# EAGLE schematic MINI_MAST (EAGLE 9.5.1)
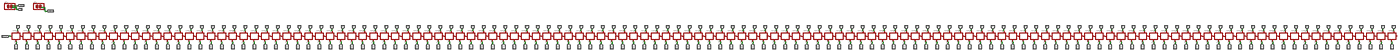
[diagram p0: schematic, sheet 1, overview]
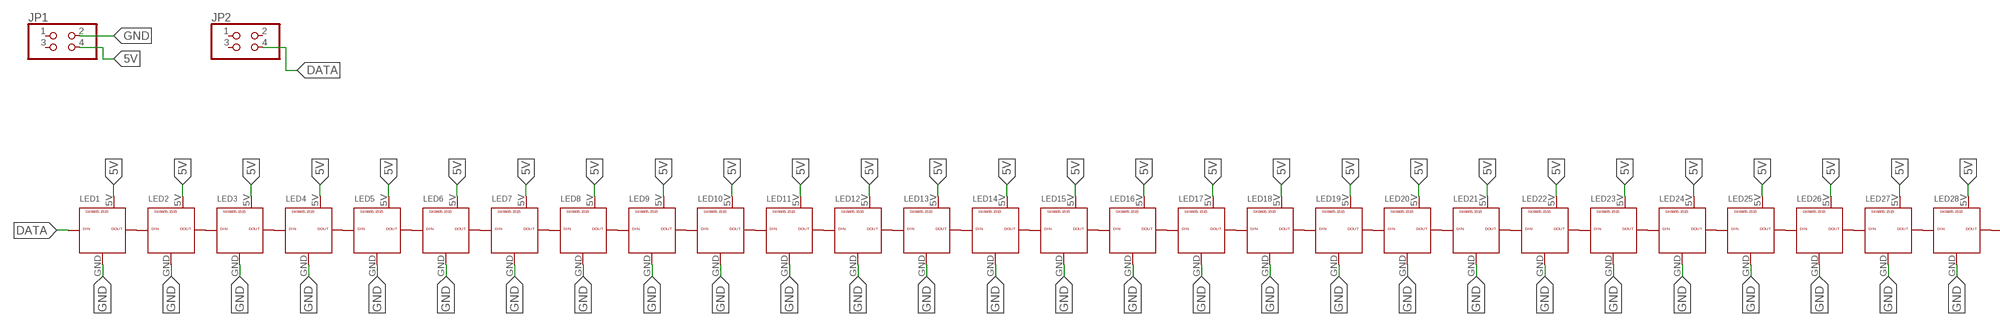
[diagram p1: schematic, sheet 1, part 1 of 6]
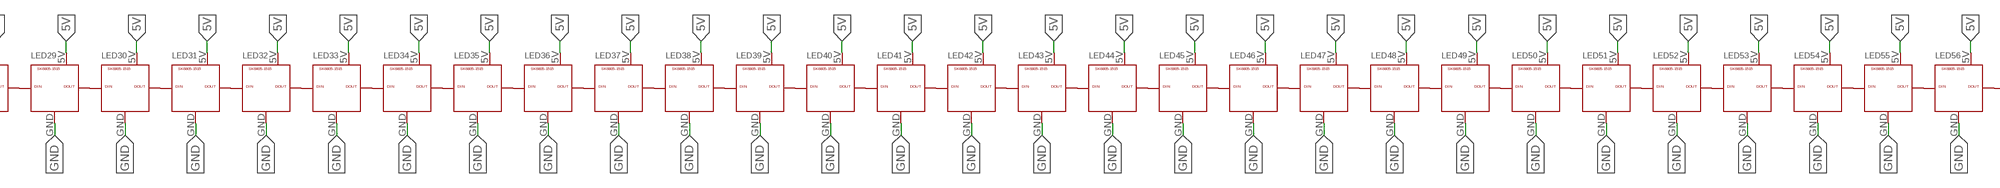
[diagram p2: schematic, sheet 1, part 2 of 6]
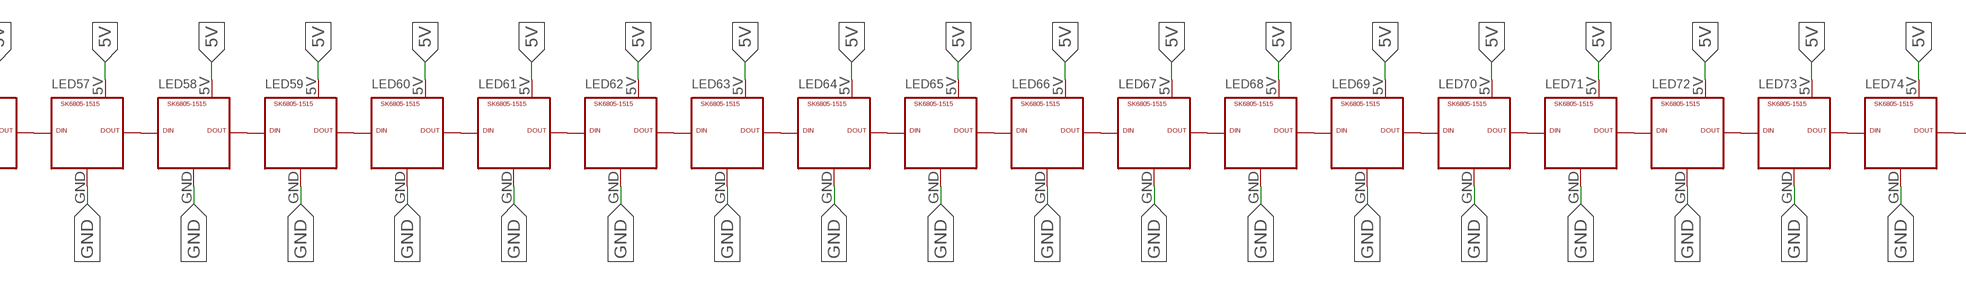
[diagram p3: schematic, sheet 1, part 3 of 6]
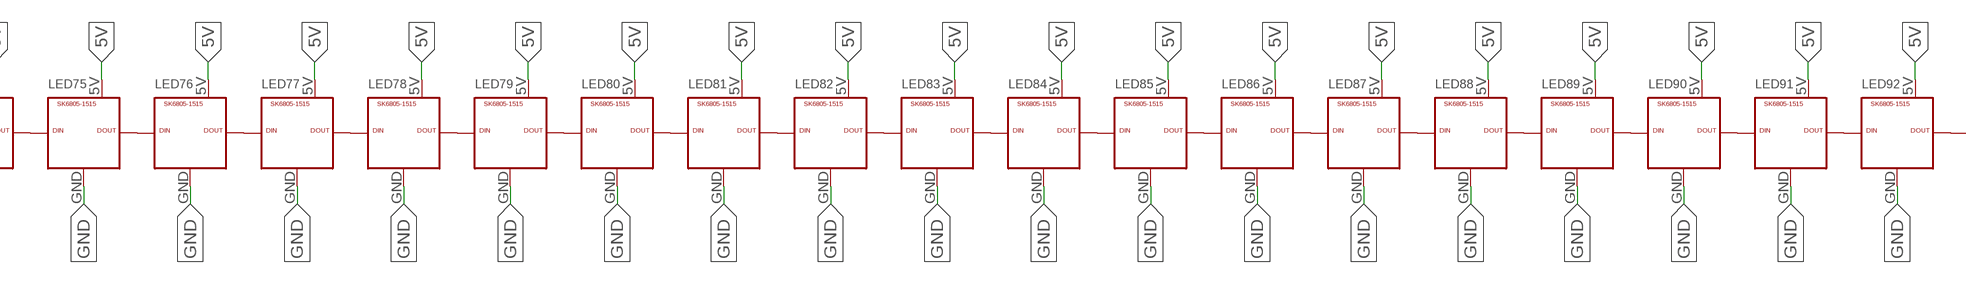
[diagram p4: schematic, sheet 1, part 4 of 6]
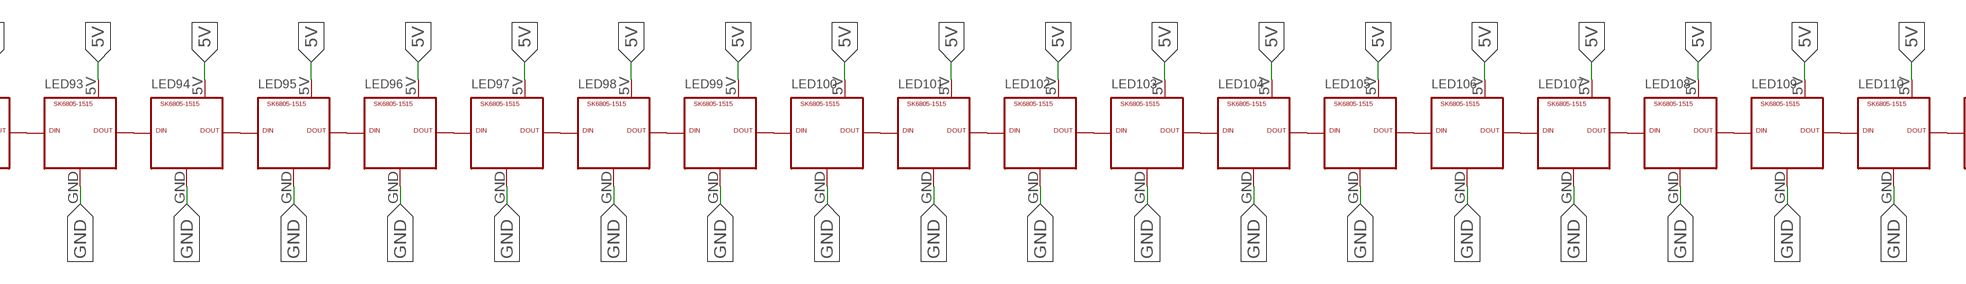
[diagram p5: schematic, sheet 1, part 5 of 6]
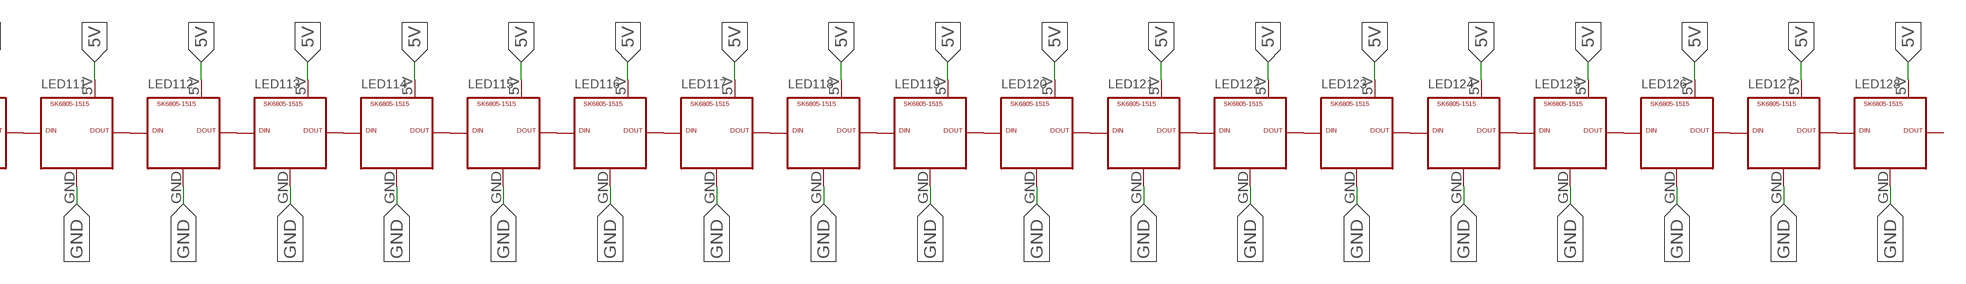
[diagram p6: schematic, sheet 1, part 6 of 6]

## Parts
JP1  PINHD-2X2/90  [2X02/90]
JP2  PINHD-2X2/90  [2X02/90]
LED1  SK6805-1515  [1515]
LED2  SK6805-1515  [1515]
LED3  SK6805-1515  [1515]
LED4  SK6805-1515  [1515]
LED5  SK6805-1515  [1515]
LED6  SK6805-1515  [1515]
LED7  SK6805-1515  [1515]
LED8  SK6805-1515  [1515]
LED9  SK6805-1515  [1515]
LED10  SK6805-1515  [1515]
LED11  SK6805-1515  [1515]
LED12  SK6805-1515  [1515]
LED13  SK6805-1515  [1515]
LED14  SK6805-1515  [1515]
LED15  SK6805-1515  [1515]
LED16  SK6805-1515  [1515]
LED17  SK6805-1515  [1515]
LED18  SK6805-1515  [1515]
LED19  SK6805-1515  [1515]
LED20  SK6805-1515  [1515]
LED21  SK6805-1515  [1515]
LED22  SK6805-1515  [1515]
LED23  SK6805-1515  [1515]
LED24  SK6805-1515  [1515]
LED25  SK6805-1515  [1515]
LED26  SK6805-1515  [1515]
LED27  SK6805-1515  [1515]
LED28  SK6805-1515  [1515]
LED29  SK6805-1515  [1515]
LED30  SK6805-1515  [1515]
LED31  SK6805-1515  [1515]
LED32  SK6805-1515  [1515]
LED33  SK6805-1515  [1515]
LED34  SK6805-1515  [1515]
LED35  SK6805-1515  [1515]
LED36  SK6805-1515  [1515]
LED37  SK6805-1515  [1515]
LED38  SK6805-1515  [1515]
LED39  SK6805-1515  [1515]
LED40  SK6805-1515  [1515]
LED41  SK6805-1515  [1515]
LED42  SK6805-1515  [1515]
LED43  SK6805-1515  [1515]
LED44  SK6805-1515  [1515]
LED45  SK6805-1515  [1515]
LED46  SK6805-1515  [1515]
LED47  SK6805-1515  [1515]
LED48  SK6805-1515  [1515]
LED49  SK6805-1515  [1515]
LED50  SK6805-1515  [1515]
LED51  SK6805-1515  [1515]
LED52  SK6805-1515  [1515]
LED53  SK6805-1515  [1515]
LED54  SK6805-1515  [1515]
LED55  SK6805-1515  [1515]
LED56  SK6805-1515  [1515]
LED57  SK6805-1515  [1515]
LED58  SK6805-1515  [1515]
LED59  SK6805-1515  [1515]
LED60  SK6805-1515  [1515]
LED61  SK6805-1515  [1515]
LED62  SK6805-1515  [1515]
LED63  SK6805-1515  [1515]
LED64  SK6805-1515  [1515]
LED65  SK6805-1515  [1515]
LED66  SK6805-1515  [1515]
LED67  SK6805-1515  [1515]
LED68  SK6805-1515  [1515]
LED69  SK6805-1515  [1515]
LED70  SK6805-1515  [1515]
LED71  SK6805-1515  [1515]
LED72  SK6805-1515  [1515]
LED73  SK6805-1515  [1515]
LED74  SK6805-1515  [1515]
LED75  SK6805-1515  [1515]
LED76  SK6805-1515  [1515]
LED77  SK6805-1515  [1515]
LED78  SK6805-1515  [1515]
LED79  SK6805-1515  [1515]
LED80  SK6805-1515  [1515]
LED81  SK6805-1515  [1515]
LED82  SK6805-1515  [1515]
LED83  SK6805-1515  [1515]
LED84  SK6805-1515  [1515]
LED85  SK6805-1515  [1515]
LED86  SK6805-1515  [1515]
LED87  SK6805-1515  [1515]
LED88  SK6805-1515  [1515]
LED89  SK6805-1515  [1515]
LED90  SK6805-1515  [1515]
LED91  SK6805-1515  [1515]
LED92  SK6805-1515  [1515]
LED93  SK6805-1515  [1515]
LED94  SK6805-1515  [1515]
LED95  SK6805-1515  [1515]
LED96  SK6805-1515  [1515]
LED97  SK6805-1515  [1515]
LED98  SK6805-1515  [1515]
LED99  SK6805-1515  [1515]
LED100  SK6805-1515  [1515]
LED101  SK6805-1515  [1515]
LED102  SK6805-1515  [1515]
LED103  SK6805-1515  [1515]
LED104  SK6805-1515  [1515]
LED105  SK6805-1515  [1515]
LED106  SK6805-1515  [1515]
LED107  SK6805-1515  [1515]
LED108  SK6805-1515  [1515]
LED109  SK6805-1515  [1515]
LED110  SK6805-1515  [1515]
LED111  SK6805-1515  [1515]
LED112  SK6805-1515  [1515]
LED113  SK6805-1515  [1515]
LED114  SK6805-1515  [1515]
LED115  SK6805-1515  [1515]
LED116  SK6805-1515  [1515]
LED117  SK6805-1515  [1515]
LED118  SK6805-1515  [1515]
LED119  SK6805-1515  [1515]
LED120  SK6805-1515  [1515]
LED121  SK6805-1515  [1515]
LED122  SK6805-1515  [1515]
LED123  SK6805-1515  [1515]
LED124  SK6805-1515  [1515]
LED125  SK6805-1515  [1515]
LED126  SK6805-1515  [1515]
LED127  SK6805-1515  [1515]
LED128  SK6805-1515  [1515]

## Nets
5V: JP1.4 LED1.5V LED2.5V LED3.5V LED4.5V LED5.5V LED6.5V LED7.5V LED8.5V LED9.5V LED10.5V LED11.5V LED12.5V LED13.5V LED14.5V LED15.5V LED16.5V LED17.5V LED18.5V LED19.5V LED20.5V LED21.5V LED22.5V LED23.5V LED24.5V LED25.5V LED26.5V LED27.5V LED28.5V LED29.5V LED30.5V LED31.5V LED32.5V LED33.5V LED34.5V LED35.5V LED36.5V LED37.5V LED38.5V LED39.5V LED40.5V LED41.5V LED42.5V LED43.5V LED44.5V LED45.5V LED46.5V LED47.5V LED48.5V LED49.5V LED50.5V LED51.5V LED52.5V LED53.5V LED54.5V LED55.5V LED56.5V LED57.5V LED58.5V LED59.5V LED60.5V LED61.5V LED62.5V LED63.5V LED64.5V LED65.5V LED66.5V LED67.5V LED68.5V LED69.5V LED70.5V LED71.5V LED72.5V LED73.5V LED74.5V LED75.5V LED76.5V LED77.5V LED78.5V LED79.5V LED80.5V LED81.5V LED82.5V LED83.5V LED84.5V LED85.5V LED86.5V LED87.5V LED88.5V LED89.5V LED90.5V LED91.5V LED92.5V LED93.5V LED94.5V LED95.5V LED96.5V LED97.5V LED98.5V LED99.5V LED100.5V LED101.5V LED102.5V LED103.5V LED104.5V LED105.5V LED106.5V LED107.5V LED108.5V LED109.5V LED110.5V LED111.5V LED112.5V LED113.5V LED114.5V LED115.5V LED116.5V LED117.5V LED118.5V LED119.5V LED120.5V LED121.5V LED122.5V LED123.5V LED124.5V LED125.5V LED126.5V LED127.5V LED128.5V
DATA: JP2.4 LED1.DIN
DATA1: LED8.DOUT LED9.DIN
DATA2: LED24.DOUT LED25.DIN
DATA3: LED40.DOUT LED41.DIN
DATA4: LED56.DOUT LED57.DIN
DATA5: LED64.DOUT LED65.DIN
DATA6: LED72.DOUT LED73.DIN
DATA7: LED88.DOUT LED89.DIN
DATA8: LED104.DOUT LED105.DIN
DATA9: LED120.DOUT LED121.DIN
GND: JP1.2 LED1.GND LED2.GND LED3.GND LED4.GND LED5.GND LED6.GND LED7.GND LED8.GND LED9.GND LED10.GND LED11.GND LED12.GND LED13.GND LED14.GND LED15.GND LED16.GND LED17.GND LED18.GND LED19.GND LED20.GND LED21.GND LED22.GND LED23.GND LED24.GND LED25.GND LED26.GND LED27.GND LED28.GND LED29.GND LED30.GND LED31.GND LED32.GND LED33.GND LED34.GND LED35.GND LED36.GND LED37.GND LED38.GND LED39.GND LED40.GND LED41.GND LED42.GND LED43.GND LED44.GND LED45.GND LED46.GND LED47.GND LED48.GND LED49.GND LED50.GND LED51.GND LED52.GND LED53.GND LED54.GND LED55.GND LED56.GND LED57.GND LED58.GND LED59.GND LED60.GND LED61.GND LED62.GND LED63.GND LED64.GND LED65.GND LED66.GND LED67.GND LED68.GND LED69.GND LED70.GND LED71.GND LED72.GND LED73.GND LED74.GND LED75.GND LED76.GND LED77.GND LED78.GND LED79.GND LED80.GND LED81.GND LED82.GND LED83.GND LED84.GND LED85.GND LED86.GND LED87.GND LED88.GND LED89.GND LED90.GND LED91.GND LED92.GND LED93.GND LED94.GND LED95.GND LED96.GND LED97.GND LED98.GND LED99.GND LED100.GND LED101.GND LED102.GND LED103.GND LED104.GND LED105.GND LED106.GND LED107.GND LED108.GND LED109.GND LED110.GND LED111.GND LED112.GND LED113.GND LED114.GND LED115.GND LED116.GND LED117.GND LED118.GND LED119.GND LED120.GND LED121.GND LED122.GND LED123.GND LED124.GND LED125.GND LED126.GND LED127.GND LED128.GND
N$1: LED1.DOUT LED2.DIN
N$2: LED3.DOUT LED4.DIN
N$3: LED2.DOUT LED3.DIN
N$4: LED5.DOUT LED6.DIN
N$5: LED7.DOUT LED8.DIN
N$6: LED6.DOUT LED7.DIN
N$7: LED4.DOUT LED5.DIN
N$8: LED9.DOUT LED10.DIN
N$9: LED11.DOUT LED12.DIN
N$10: LED10.DOUT LED11.DIN
N$11: LED13.DOUT LED14.DIN
N$12: LED15.DOUT LED16.DIN
N$13: LED14.DOUT LED15.DIN
N$14: LED12.DOUT LED13.DIN
N$15: LED17.DOUT LED18.DIN
N$16: LED19.DOUT LED20.DIN
N$17: LED18.DOUT LED19.DIN
N$18: LED21.DOUT LED22.DIN
N$19: LED23.DOUT LED24.DIN
N$20: LED22.DOUT LED23.DIN
N$21: LED20.DOUT LED21.DIN
N$22: LED25.DOUT LED26.DIN
N$23: LED27.DOUT LED28.DIN
N$24: LED26.DOUT LED27.DIN
N$25: LED29.DOUT LED30.DIN
N$26: LED31.DOUT LED32.DIN
N$27: LED30.DOUT LED31.DIN
N$28: LED28.DOUT LED29.DIN
N$29: LED16.DOUT LED17.DIN
N$30: LED33.DOUT LED34.DIN
N$31: LED35.DOUT LED36.DIN
N$32: LED34.DOUT LED35.DIN
N$33: LED37.DOUT LED38.DIN
N$34: LED39.DOUT LED40.DIN
N$35: LED38.DOUT LED39.DIN
N$36: LED36.DOUT LED37.DIN
N$37: LED41.DOUT LED42.DIN
N$38: LED43.DOUT LED44.DIN
N$39: LED42.DOUT LED43.DIN
N$40: LED45.DOUT LED46.DIN
N$41: LED47.DOUT LED48.DIN
N$42: LED46.DOUT LED47.DIN
N$43: LED44.DOUT LED45.DIN
N$44: LED49.DOUT LED50.DIN
N$45: LED51.DOUT LED52.DIN
N$46: LED50.DOUT LED51.DIN
N$47: LED53.DOUT LED54.DIN
N$48: LED55.DOUT LED56.DIN
N$49: LED54.DOUT LED55.DIN
N$50: LED52.DOUT LED53.DIN
N$51: LED57.DOUT LED58.DIN
N$52: LED59.DOUT LED60.DIN
N$53: LED58.DOUT LED59.DIN
N$54: LED61.DOUT LED62.DIN
N$55: LED63.DOUT LED64.DIN
N$56: LED62.DOUT LED63.DIN
N$57: LED60.DOUT LED61.DIN
N$58: LED48.DOUT LED49.DIN
N$59: LED32.DOUT LED33.DIN
N$60: LED65.DOUT LED66.DIN
N$61: LED67.DOUT LED68.DIN
N$62: LED66.DOUT LED67.DIN
N$63: LED69.DOUT LED70.DIN
N$64: LED71.DOUT LED72.DIN
N$65: LED70.DOUT LED71.DIN
N$66: LED68.DOUT LED69.DIN
N$67: LED73.DOUT LED74.DIN
N$68: LED75.DOUT LED76.DIN
N$69: LED74.DOUT LED75.DIN
N$70: LED77.DOUT LED78.DIN
N$71: LED79.DOUT LED80.DIN
N$72: LED78.DOUT LED79.DIN
N$73: LED76.DOUT LED77.DIN
N$74: LED81.DOUT LED82.DIN
N$75: LED83.DOUT LED84.DIN
N$76: LED82.DOUT LED83.DIN
N$77: LED85.DOUT LED86.DIN
N$78: LED87.DOUT LED88.DIN
N$79: LED86.DOUT LED87.DIN
N$80: LED84.DOUT LED85.DIN
N$81: LED89.DOUT LED90.DIN
N$82: LED91.DOUT LED92.DIN
N$83: LED90.DOUT LED91.DIN
N$84: LED93.DOUT LED94.DIN
N$85: LED95.DOUT LED96.DIN
N$86: LED94.DOUT LED95.DIN
N$87: LED92.DOUT LED93.DIN
N$88: LED80.DOUT LED81.DIN
N$89: LED97.DOUT LED98.DIN
N$90: LED99.DOUT LED100.DIN
N$91: LED98.DOUT LED99.DIN
N$92: LED101.DOUT LED102.DIN
N$93: LED103.DOUT LED104.DIN
N$94: LED102.DOUT LED103.DIN
N$95: LED100.DOUT LED101.DIN
N$96: LED105.DOUT LED106.DIN
N$97: LED107.DOUT LED108.DIN
N$98: LED106.DOUT LED107.DIN
N$99: LED109.DOUT LED110.DIN
N$100: LED111.DOUT LED112.DIN
N$101: LED110.DOUT LED111.DIN
N$102: LED108.DOUT LED109.DIN
N$103: LED113.DOUT LED114.DIN
N$104: LED115.DOUT LED116.DIN
N$105: LED114.DOUT LED115.DIN
N$106: LED117.DOUT LED118.DIN
N$107: LED119.DOUT LED120.DIN
N$108: LED118.DOUT LED119.DIN
N$109: LED116.DOUT LED117.DIN
N$110: LED121.DOUT LED122.DIN
N$111: LED123.DOUT LED124.DIN
N$112: LED122.DOUT LED123.DIN
N$113: LED125.DOUT LED126.DIN
N$114: LED127.DOUT LED128.DIN
N$115: LED126.DOUT LED127.DIN
N$116: LED124.DOUT LED125.DIN
N$117: LED112.DOUT LED113.DIN
N$118: LED96.DOUT LED97.DIN
Unconnected: JP1.1 JP1.3 JP2.1 JP2.2 JP2.3 LED128.DOUT

## Library data of the parts
JP1 JP2 = pinhead:PINHD-2X2: PIN HEADER
LED1-LED128 = SK6805-1515:SK6805-1515